# EAGLE schematic ADC Board(Single Board) (EAGLE 7.6.0)
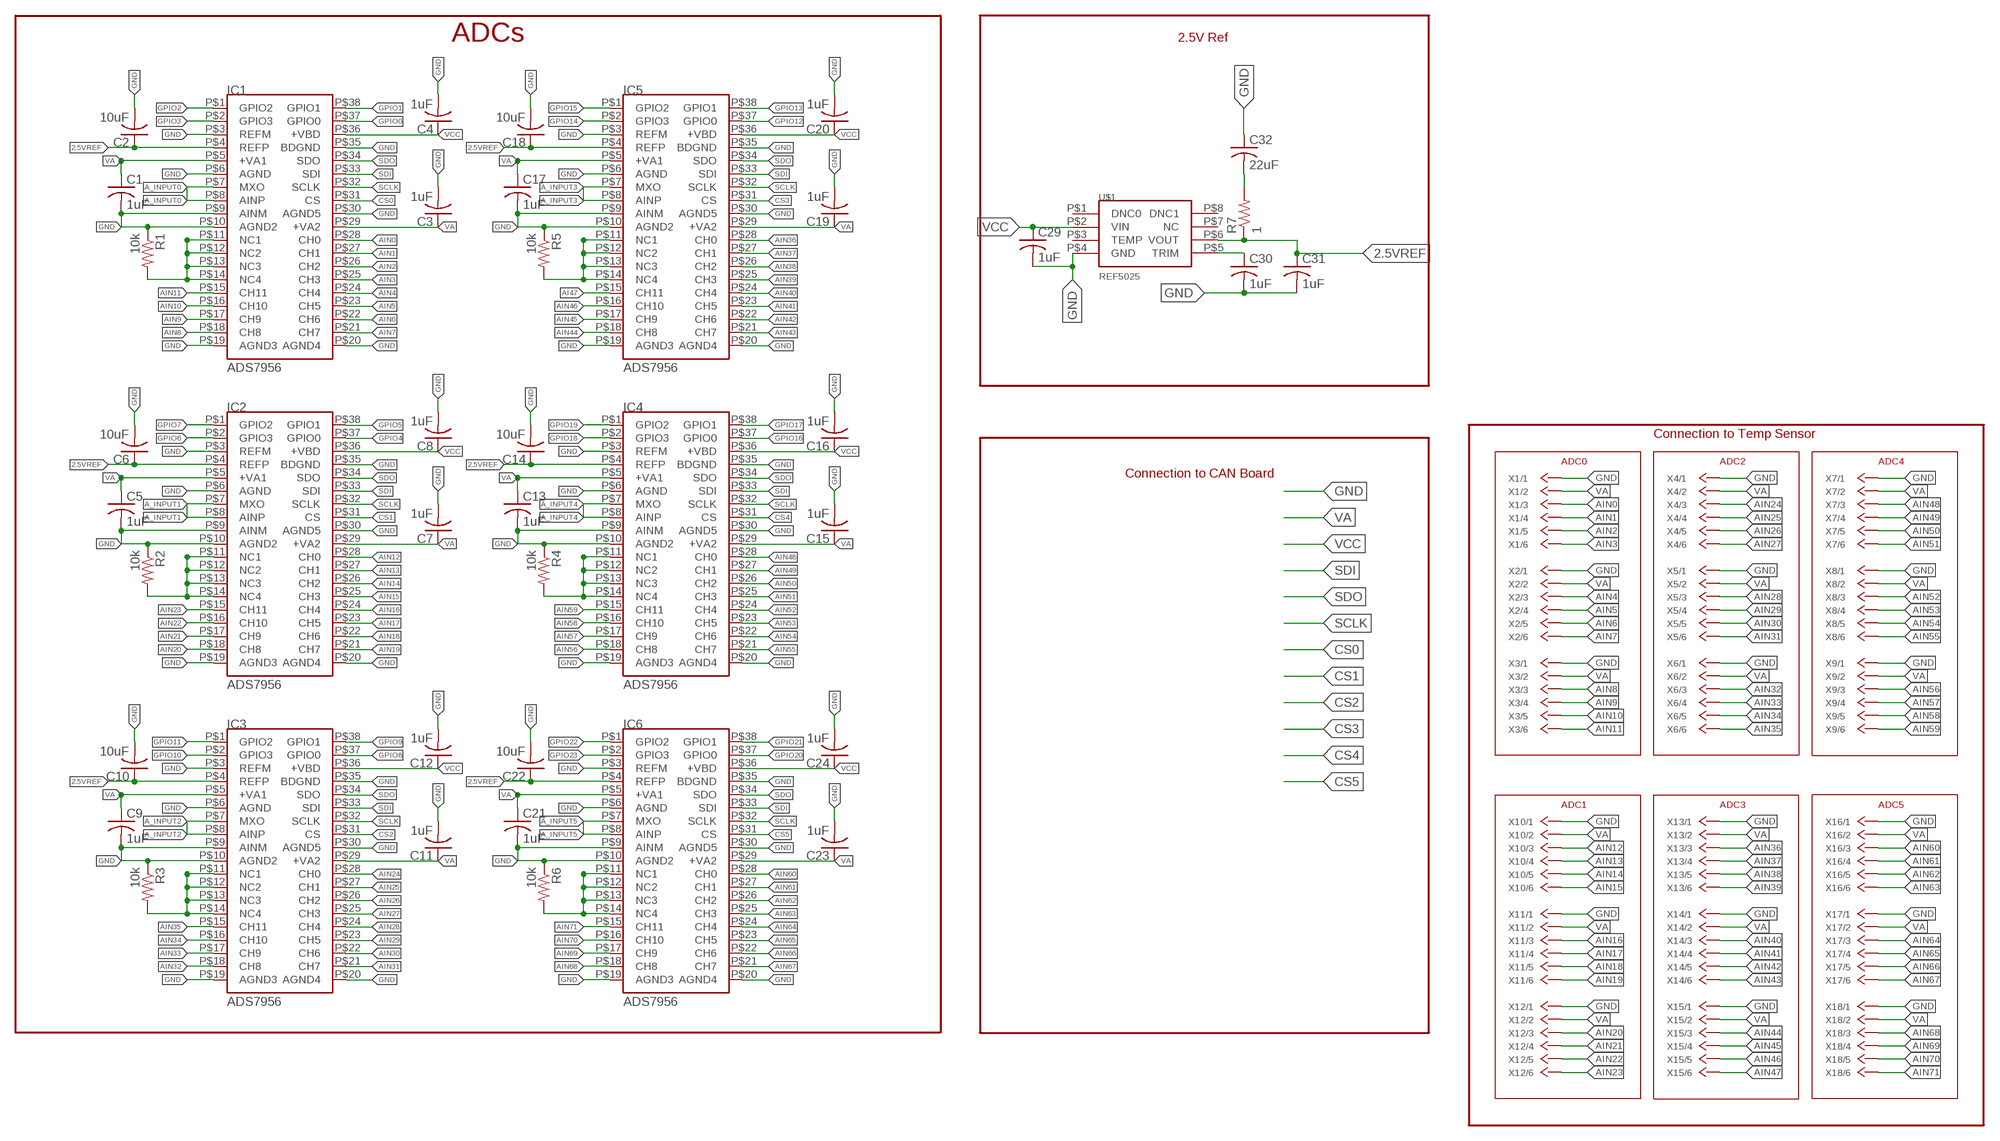
[diagram p0: schematic, sheet 1]

## Parts
C1  1uF  C-USC0603  [C0603]
C2  10uF  C-USC0603  [C0603]
C3  1uF  C-USC0603  [C0603]
C4  1uF  C-USC0603  [C0603]
C5  1uF  C-USC0603  [C0603]
C6  10uF  C-USC0603  [C0603]
C7  1uF  C-USC0603  [C0603]
C8  1uF  C-USC0603  [C0603]
C9  1uF  C-USC0603  [C0603]
C10  10uF  C-USC0603  [C0603]
C11  1uF  C-USC0603  [C0603]
C12  1uF  C-USC0603  [C0603]
C13  1uF  C-USC0603  [C0603]
C14  10uF  C-USC0603  [C0603]
C15  1uF  C-USC0603  [C0603]
C16  1uF  C-USC0603  [C0603]
C17  1uF  C-USC0603  [C0603]
C18  10uF  C-USC0603  [C0603]
C19  1uF  C-USC0603  [C0603]
C20  1uF  C-USC0603  [C0603]
C21  1uF  C-USC0603  [C0603]
C22  10uF  C-USC0603  [C0603]
C23  1uF  C-USC0603  [C0603]
C24  1uF  C-USC0603  [C0603]
C29  1uF  C-USC0603  [C0603]
C30  1uF  C-USC0603  [C0603]
C31  1uF  C-USC0603  [C0603]
C32  22uF  C-USC0603  [C0603]
IC1  ADS7956  [TSSOP-38]
IC2  ADS7956  [TSSOP-38]
IC3  ADS7956  [TSSOP-38]
IC4  ADS7956  [TSSOP-38]
IC5  ADS7956  [TSSOP-38]
IC6  ADS7956  [TSSOP-38]
R1  10k  R-US_R0603  [R0603]
R2  10k  R-US_R0603  [R0603]
R3  10k  R-US_R0603  [R0603]
R4  10k  R-US_R0603  [R0603]
R5  10k  R-US_R0603  [R0603]
R6  10k  R-US_R0603  [R0603]
R7  1  R-US_M0805  [M0805]
U$1  REF5025  [TSSOP-8(TI)]
X1  6_PIN_CONNTE_IDC  [2178710_IDC]
X2  6_PIN_CONNTE_IDC  [2178710_IDC]
X3  6_PIN_CONNTE_IDC  [2178710_IDC]
X4  6_PIN_CONNTE_IDC  [2178710_IDC]
X5  6_PIN_CONNTE_IDC  [2178710_IDC]
X6  6_PIN_CONNTE_IDC  [2178710_IDC]
X7  6_PIN_CONNTE_IDC  [2178710_IDC]
X8  6_PIN_CONNTE_IDC  [2178710_IDC]
X9  6_PIN_CONNTE_IDC  [2178710_IDC]
X10  6_PIN_CONNTE_IDC  [2178710_IDC]
X11  6_PIN_CONNTE_IDC  [2178710_IDC]
X12  6_PIN_CONNTE_IDC  [2178710_IDC]
X13  6_PIN_CONNTE_IDC  [2178710_IDC]
X14  6_PIN_CONNTE_IDC  [2178710_IDC]
X15  6_PIN_CONNTE_IDC  [2178710_IDC]
X16  6_PIN_CONNTE_IDC  [2178710_IDC]
X17  6_PIN_CONNTE_IDC  [2178710_IDC]
X18  6_PIN_CONNTE_IDC  [2178710_IDC]

## Nets
2.5VREF: C2.1 C6.1 C10.1 C14.1 C18.1 C22.1 C31.1 IC1.P$4(REFP) IC2.P$4(REFP) IC3.P$4(REFP) IC4.P$4(REFP) IC5.P$4(REFP) IC6.P$4(REFP) R7.1 U$1.P$6(VOUT)
A_INPUT0: IC1.P$7(MXO) IC1.P$8(AINP)
A_INPUT1: IC2.P$7(MXO) IC2.P$8(AINP)
A_INPUT2: IC3.P$7(MXO) IC3.P$8(AINP)
A_INPUT3: IC5.P$7(MXO) IC5.P$8(AINP)
A_INPUT4: IC4.P$7(MXO) IC4.P$8(AINP)
A_INPUT5: IC6.P$7(MXO) IC6.P$8(AINP)
AI47: IC5.P$15(CH11)
AIN0: IC1.P$28(CH0) X1.P$3
AIN1: IC1.P$27(CH1) X1.P$4
AIN2: IC1.P$26(CH2) X1.P$5
AIN3: IC1.P$25(CH3) X1.P$6
AIN4: IC1.P$24(CH4) X2.P$3
AIN5: IC1.P$23(CH5) X2.P$4
AIN6: IC1.P$22(CH6) X2.P$5
AIN7: IC1.P$21(CH7) X2.P$6
AIN8: IC1.P$18(CH8) X3.P$3
AIN9: IC1.P$17(CH9) X3.P$4
AIN10: IC1.P$16(CH10) X3.P$5
AIN11: IC1.P$15(CH11) X3.P$6
AIN12: IC2.P$28(CH0) X10.P$3
AIN13: IC2.P$27(CH1) X10.P$4
AIN14: IC2.P$26(CH2) X10.P$5
AIN15: IC2.P$25(CH3) X10.P$6
AIN16: IC2.P$24(CH4) X11.P$3
AIN17: IC2.P$23(CH5) X11.P$4
AIN18: IC2.P$22(CH6) X11.P$5
AIN19: IC2.P$21(CH7) X11.P$6
AIN20: IC2.P$18(CH8) X12.P$3
AIN21: IC2.P$17(CH9) X12.P$4
AIN22: IC2.P$16(CH10) X12.P$5
AIN23: IC2.P$15(CH11) X12.P$6
AIN24: IC3.P$28(CH0) X4.P$3
AIN25: IC3.P$27(CH1) X4.P$4
AIN26: IC3.P$26(CH2) X4.P$5
AIN27: IC3.P$25(CH3) X4.P$6
AIN28: IC3.P$24(CH4) X5.P$3
AIN29: IC3.P$23(CH5) X5.P$4
AIN30: IC3.P$22(CH6) X5.P$5
AIN31: IC3.P$21(CH7) X5.P$6
AIN32: IC3.P$18(CH8) X6.P$3
AIN33: IC3.P$17(CH9) X6.P$4
AIN34: IC3.P$16(CH10) X6.P$5
AIN35: IC3.P$15(CH11) X6.P$6
AIN36: IC5.P$28(CH0) X13.P$3
AIN37: IC5.P$27(CH1) X13.P$4
AIN38: IC5.P$26(CH2) X13.P$5
AIN39: IC5.P$25(CH3) X13.P$6
AIN40: IC5.P$24(CH4) X14.P$3
AIN41: IC5.P$23(CH5) X14.P$4
AIN42: IC5.P$22(CH6) X14.P$5
AIN43: IC5.P$21(CH7) X14.P$6
AIN44: IC5.P$18(CH8) X15.P$3
AIN45: IC5.P$17(CH9) X15.P$4
AIN46: IC5.P$16(CH10) X15.P$5
AIN47: X15.P$6
AIN48: IC4.P$28(CH0) X7.P$3
AIN49: IC4.P$27(CH1) X7.P$4
AIN50: IC4.P$26(CH2) X7.P$5
AIN51: IC4.P$25(CH3) X7.P$6
AIN52: IC4.P$24(CH4) X8.P$3
AIN53: IC4.P$23(CH5) X8.P$4
AIN54: IC4.P$22(CH6) X8.P$5
AIN55: IC4.P$21(CH7) X8.P$6
AIN56: IC4.P$18(CH8) X9.P$3
AIN57: IC4.P$17(CH9) X9.P$4
AIN58: IC4.P$16(CH10) X9.P$5
AIN59: IC4.P$15(CH11) X9.P$6
AIN60: IC6.P$28(CH0) X16.P$3
AIN61: IC6.P$27(CH1) X16.P$4
AIN62: IC6.P$26(CH2) X16.P$5
AIN63: IC6.P$25(CH3) X16.P$6
AIN64: IC6.P$24(CH4) X17.P$3
AIN65: IC6.P$23(CH5) X17.P$4
AIN66: IC6.P$22(CH6) X17.P$5
AIN67: IC6.P$21(CH7) X17.P$6
AIN68: IC6.P$18(CH8) X18.P$3
AIN69: IC6.P$17(CH9) X18.P$4
AIN70: IC6.P$16(CH10) X18.P$5
AIN71: IC6.P$15(CH11) X18.P$6
CS0: IC1.P$31(CS)
CS1: IC2.P$31(CS)
CS2: IC3.P$31(CS)
CS3: IC5.P$31(CS)
CS4: IC4.P$31(CS)
CS5: IC6.P$31(CS)
GND: C1.2 C2.2 C3.2 C4.2 C5.2 C6.2 C7.2 C8.2 C9.2 C10.2 C11.2 C12.2 C13.2 C14.2 C15.2 C16.2 C17.2 C18.2 C19.2 C20.2 C21.2 C22.2 C23.2 C24.2 C29.2 C30.2 C31.2 C32.1 IC1.P$3(REFM) IC1.P$6(AGND) IC1.P$9(AINM) IC1.P$10(AGND2) IC1.P$19(AGND3) IC1.P$20(AGND4) IC1.P$30(AGND5) IC1.P$35(BDGND) IC2.P$3(REFM) IC2.P$6(AGND) IC2.P$9(AINM) IC2.P$10(AGND2) IC2.P$19(AGND3) IC2.P$20(AGND4) IC2.P$30(AGND5) IC2.P$35(BDGND) IC3.P$3(REFM) IC3.P$6(AGND) IC3.P$9(AINM) IC3.P$10(AGND2) IC3.P$19(AGND3) IC3.P$20(AGND4) IC3.P$30(AGND5) IC3.P$35(BDGND) IC4.P$3(REFM) IC4.P$6(AGND) IC4.P$9(AINM) IC4.P$10(AGND2) IC4.P$19(AGND3) IC4.P$20(AGND4) IC4.P$30(AGND5) IC4.P$35(BDGND) IC5.P$3(REFM) IC5.P$6(AGND) IC5.P$9(AINM) IC5.P$10(AGND2) IC5.P$19(AGND3) IC5.P$20(AGND4) IC5.P$30(AGND5) IC5.P$35(BDGND) IC6.P$3(REFM) IC6.P$6(AGND) IC6.P$9(AINM) IC6.P$10(AGND2) IC6.P$19(AGND3) IC6.P$20(AGND4) IC6.P$30(AGND5) IC6.P$35(BDGND) R1.1 R2.1 R3.1 R4.1 R5.1 R6.1 U$1.P$4(GND) X1.P$1 X2.P$1 X3.P$1 X4.P$1 X5.P$1 X6.P$1 X7.P$1 X8.P$1 X9.P$1 X10.P$1 X11.P$1 X12.P$1 X13.P$1 X14.P$1 X15.P$1 X16.P$1 X17.P$1 X18.P$1
GPIO0: IC1.P$37(GPIO0)
GPIO1: IC1.P$38(GPIO1)
GPIO2: IC1.P$1(GPIO2)
GPIO3: IC1.P$2(GPIO3)
GPIO4: IC2.P$37(GPIO0)
GPIO5: IC2.P$38(GPIO1)
GPIO6: IC2.P$2(GPIO3)
GPIO7: IC2.P$1(GPIO2)
GPIO8: IC3.P$37(GPIO0)
GPIO9: IC3.P$38(GPIO1)
GPIO10: IC3.P$2(GPIO3)
GPIO11: IC3.P$1(GPIO2)
GPIO12: IC5.P$37(GPIO0)
GPIO13: IC5.P$38(GPIO1)
GPIO14: IC5.P$2(GPIO3)
GPIO15: IC5.P$1(GPIO2)
GPIO16: IC4.P$37(GPIO0)
GPIO17: IC4.P$38(GPIO1)
GPIO18: IC4.P$2(GPIO3)
GPIO19: IC4.P$1(GPIO2)
GPIO20: IC6.P$37(GPIO0)
GPIO21: IC6.P$38(GPIO1)
GPIO22: IC6.P$1(GPIO2)
GPIO23: IC6.P$2(GPIO3)
N$3: C32.2 R7.2
NC: IC1.P$11(NC1) IC1.P$12(NC2) IC1.P$13(NC3) IC1.P$14(NC4) R1.2
NC1: IC2.P$11(NC1) IC2.P$12(NC2) IC2.P$13(NC3) IC2.P$14(NC4) R2.2
NC2: IC3.P$11(NC1) IC3.P$12(NC2) IC3.P$13(NC3) IC3.P$14(NC4) R3.2
NC3: IC4.P$11(NC1) IC4.P$12(NC2) IC4.P$13(NC3) IC4.P$14(NC4) R4.2
NC4: IC5.P$11(NC1) IC5.P$12(NC2) IC5.P$13(NC3) IC5.P$14(NC4) R5.2
NC5: IC6.P$11(NC1) IC6.P$12(NC2) IC6.P$13(NC3) IC6.P$14(NC4) R6.2
SCLK: IC1.P$32(SCLK) IC2.P$32(SCLK) IC3.P$32(SCLK) IC4.P$32(SCLK) IC5.P$32(SCLK) IC6.P$32(SCLK)
SDI: IC1.P$33(SDI) IC2.P$33(SDI) IC3.P$33(SDI) IC4.P$33(SDI) IC5.P$33(SDI) IC6.P$33(SDI)
SDO: IC1.P$34(SDO) IC2.P$34(SDO) IC3.P$34(SDO) IC4.P$34(SDO) IC5.P$34(SDO) IC6.P$34(SDO)
TRIM: C30.1 U$1.P$5(TRIM)
VA: C1.1 C3.1 C5.1 C7.1 C9.1 C11.1 C13.1 C15.1 C17.1 C19.1 C21.1 C23.1 IC1.P$5(+VA1) IC1.P$29(+VA2) IC2.P$5(+VA1) IC2.P$29(+VA2) IC3.P$5(+VA1) IC3.P$29(+VA2) IC4.P$5(+VA1) IC4.P$29(+VA2) IC5.P$5(+VA1) IC5.P$29(+VA2) IC6.P$5(+VA1) IC6.P$29(+VA2) X1.P$2 X2.P$2 X3.P$2 X4.P$2 X5.P$2 X6.P$2 X7.P$2 X8.P$2 X9.P$2 X10.P$2 X11.P$2 X12.P$2 X13.P$2 X14.P$2 X15.P$2 X16.P$2 X17.P$2 X18.P$2
VCC: C4.1 C8.1 C12.1 C16.1 C20.1 C24.1 C29.1 IC1.P$36(+VBD) IC2.P$36(+VBD) IC3.P$36(+VBD) IC4.P$36(+VBD) IC5.P$36(+VBD) IC6.P$36(+VBD) U$1.P$2(VIN)
Unconnected: U$1.P$1(DNC0) U$1.P$3(TEMP) U$1.P$7(NC) U$1.P$8(DNC1)

## Notes on the sheet
- ADCs | 2.5V Ref
- Connection to Temp Sensor
- ADC0 | ADC2 | ADC4
- Connection to CAN Board
- ADC1 | ADC3 | ADC5

## Library data of the parts
C1-C24 C29-C32 = adafruit:C-US: CAPACITOR, American symbol
IC1-IC6 = BMS Lbr:ADS7956
R1-R6 = resistor:R-US_: RESISTOR, American symbol
R7 = adafruit:R-US_: RESISTOR, American symbol
U$1 = BMS Lbr:REF5025: 2.5V Voltage Reference
X1-X18 = BMS Lbr:6_PIN_CONN: 6 Pin Connector